# EAGLE design KHR-1_Breakout_schm (EAGLE 9.1.3)
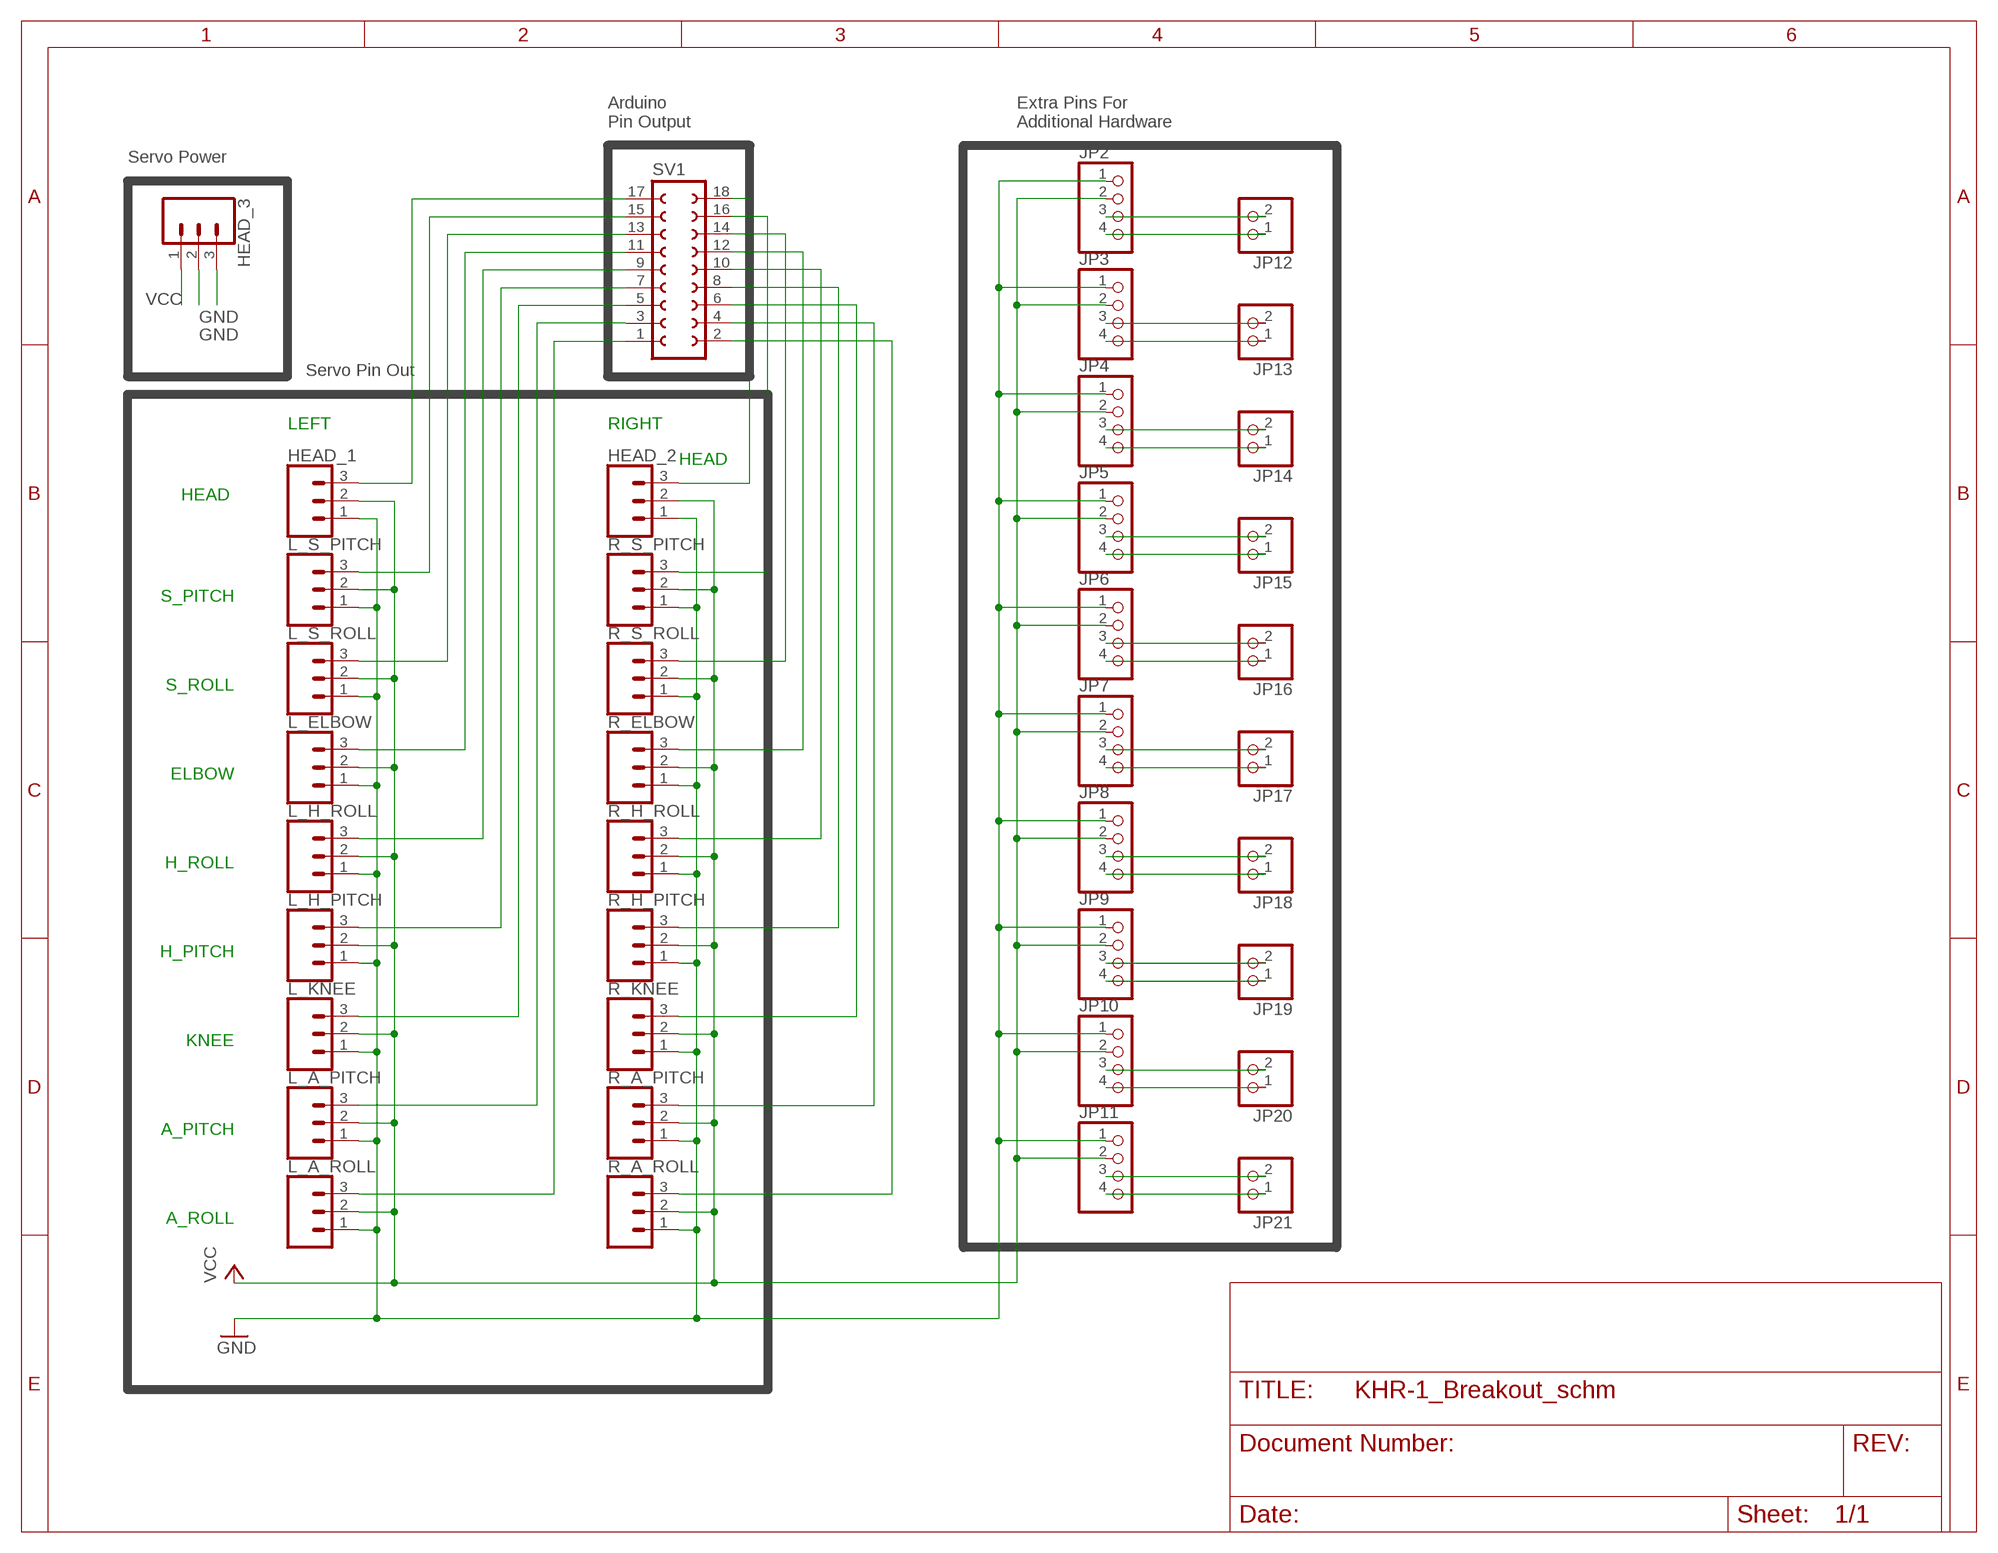
[diagram p0: schematic, sheet 1]

## Parts
HEAD_1  CONN_03  [1X03]
HEAD_2  CONN_03  [1X03]
HEAD_3  CONN_03  [1X03]
JP2  PINHD-1X4  [1X04]
JP3  PINHD-1X4  [1X04]
JP4  PINHD-1X4  [1X04]
JP5  PINHD-1X4  [1X04]
JP6  PINHD-1X4  [1X04]
JP7  PINHD-1X4  [1X04]
JP8  PINHD-1X4  [1X04]
JP9  PINHD-1X4  [1X04]
JP10  PINHD-1X4  [1X04]
JP11  PINHD-1X4  [1X04]
JP12  PINHD-1X2  [1X02]
JP13  PINHD-1X2  [1X02]
JP14  PINHD-1X2  [1X02]
JP15  PINHD-1X2  [1X02]
JP16  PINHD-1X2  [1X02]
JP17  PINHD-1X2  [1X02]
JP18  PINHD-1X2  [1X02]
JP19  PINHD-1X2  [1X02]
JP20  PINHD-1X2  [1X02]
JP21  PINHD-1X2  [1X02]
L_A_PITCH  CONN_03  [1X03]
L_A_ROLL  CONN_03  [1X03]
L_ELBOW  CONN_03  [1X03]
L_H_PITCH  CONN_03  [1X03]
L_H_ROLL  CONN_03  [1X03]
L_KNEE  CONN_03  [1X03]
L_S_PITCH  CONN_03  [1X03]
L_S_ROLL  CONN_03  [1X03]
R_A_PITCH  CONN_03  [1X03]
R_A_ROLL  CONN_03  [1X03]
R_ELBOW  CONN_03  [1X03]
R_H_PITCH  CONN_03  [1X03]
R_H_ROLL  CONN_03  [1X03]
R_KNEE  CONN_03  [1X03]
R_S_PITCH  CONN_03  [1X03]
R_S_ROLL  CONN_03  [1X03]
SV1  FE09-2  [FE09-2]

## Nets
GND: HEAD_1.1 HEAD_2.1 HEAD_3.2 HEAD_3.3 JP2.1 JP3.1 JP4.1 JP5.1 JP6.1 JP7.1 JP8.1 JP9.1 JP10.1 JP11.1 L_A_PITCH.1 L_A_ROLL.1 L_ELBOW.1 L_H_PITCH.1 L_H_ROLL.1 L_KNEE.1 L_S_PITCH.1 L_S_ROLL.1 R_A_PITCH.1 R_A_ROLL.1 R_ELBOW.1 R_H_PITCH.1 R_H_ROLL.1 R_KNEE.1 R_S_PITCH.1 R_S_ROLL.1
N$1: HEAD_1.3 SV1.17
N$2: L_S_PITCH.3 SV1.15
N$3: L_S_ROLL.3 SV1.13
N$4: L_ELBOW.3 SV1.11
N$5: L_H_ROLL.3 SV1.9
N$6: L_H_PITCH.3 SV1.7
N$7: L_KNEE.3 SV1.5
N$8: L_A_PITCH.3 SV1.3
N$9: L_A_ROLL.3 SV1.1
N$10: HEAD_2.3 SV1.18
N$11: R_S_PITCH.3 SV1.16
N$12: R_S_ROLL.3 SV1.14
N$13: R_ELBOW.3 SV1.12
N$14: R_H_ROLL.3 SV1.10
N$15: R_H_PITCH.3 SV1.8
N$16: R_KNEE.3 SV1.6
N$17: R_A_PITCH.3 SV1.4
N$18: R_A_ROLL.3 SV1.2
N$19: JP2.3 JP12.2
N$20: JP2.4 JP12.1
N$21: JP3.3 JP13.2
N$22: JP3.4 JP13.1
N$23: JP4.3 JP14.2
N$24: JP4.4 JP14.1
N$25: JP5.3 JP15.2
N$26: JP5.4 JP15.1
N$27: JP6.3 JP16.2
N$28: JP6.4 JP16.1
N$29: JP7.3 JP17.2
N$30: JP7.4 JP17.1
N$31: JP8.3 JP18.2
N$32: JP8.4 JP18.1
N$33: JP9.3 JP19.2
N$34: JP9.4 JP19.1
N$35: JP10.3 JP20.2
N$36: JP10.4 JP20.1
N$37: JP11.3 JP21.2
N$38: JP11.4 JP21.1
VCC: HEAD_1.2 HEAD_2.2 HEAD_3.1 JP2.2 JP3.2 JP4.2 JP5.2 JP6.2 JP7.2 JP8.2 JP9.2 JP10.2 JP11.2 L_A_PITCH.2 L_A_ROLL.2 L_ELBOW.2 L_H_PITCH.2 L_H_ROLL.2 L_KNEE.2 L_S_PITCH.2 L_S_ROLL.2 R_A_PITCH.2 R_A_ROLL.2 R_ELBOW.2 R_H_PITCH.2 R_H_ROLL.2 R_KNEE.2 R_S_PITCH.2 R_S_ROLL.2

## Notes on the sheet
- Arduino
  Pin Output
- Extra Pins For
  Additional Hardware
- Servo Power
- Servo Pin Out
- LEFT | RIGHT
- HEAD
- HEAD
- S_PITCH
- S_ROLL
- ELBOW
- H_ROLL
- H_PITCH
- KNEE
- A_PITCH
- A_ROLL

## Library data of the parts
HEAD_1-HEAD_3 L_A_PITCH L_A_ROLL L_ELBOW L_H_PITCH L_H_ROLL L_KNEE L_S_PITCH L_S_ROLL R_A_PITCH R_A_ROLL R_ELBOW R_H_PITCH R_H_ROLL R_KNEE R_S_PITCH R_S_ROLL = SparkFun-Connectors:CONN_03: Multi connection point. Often used as Generic Header-pin footprint for 0.1 inch spaced/style header connections On any of the 0.1 inch spaced packages, you can populate with these: Break Away Headers - Straight <https://www.sparkfun.com/products/116> (PRT-00116) Break Away Male Headers - Right Angle <https://www.sparkfun.com/products/553> (PRT-00553) Female Headers <https://www.sparkfun.com/products/115> (PRT-00115) Break Away Headers - Machine Pin <https://www.sparkfun.com/products/117> (PRT-00117) Break Away Female Headers - Swiss Machine Pin <https://www.sparkfun.com/products/743> (PRT-00743) Stackable Header - 3 Pin (Female, 0.1") <https://www.sparkfun.com/products/13875> (PRT-13875) For SCREWTERMINALS and SPRING TERMINALS visit here: Screw Terimnals on SparkFun.com <https://www.sparkfun.com/search/results?term=Screw+Terminals> (5mm/3.5mm/2.54mm spacing) This device is also useful as a general connection point to wire up your design to another part of your project. Our various solder wires solder well into these plated through hole pads. Hook-Up Wire - Assortment (Stranded, 22 AWG) <https://www.sparkfun.com/products/11375> (PRT-11375) Hook-Up Wire - Assortment (Solid Core, 22 AWG) <https://www.sparkfun.com/products/11367> (PRT-11367) View the entire wire category on our website here <https://www.sparkfun.com/categories/141> Special notes: Molex polarized connector foot print use with SKU : PRT-08232 with associated crimp pins and housings.
JP2-JP11 = pinhead:PINHD-1X4: PIN HEADER
JP12-JP21 = pinhead:PINHD-1X2: PIN HEADER
SV1 = con-lsta:FE09-2: FEMALE HEADER; OC_FARNELL: unknown; OC_NEWARK: unknown

## Board
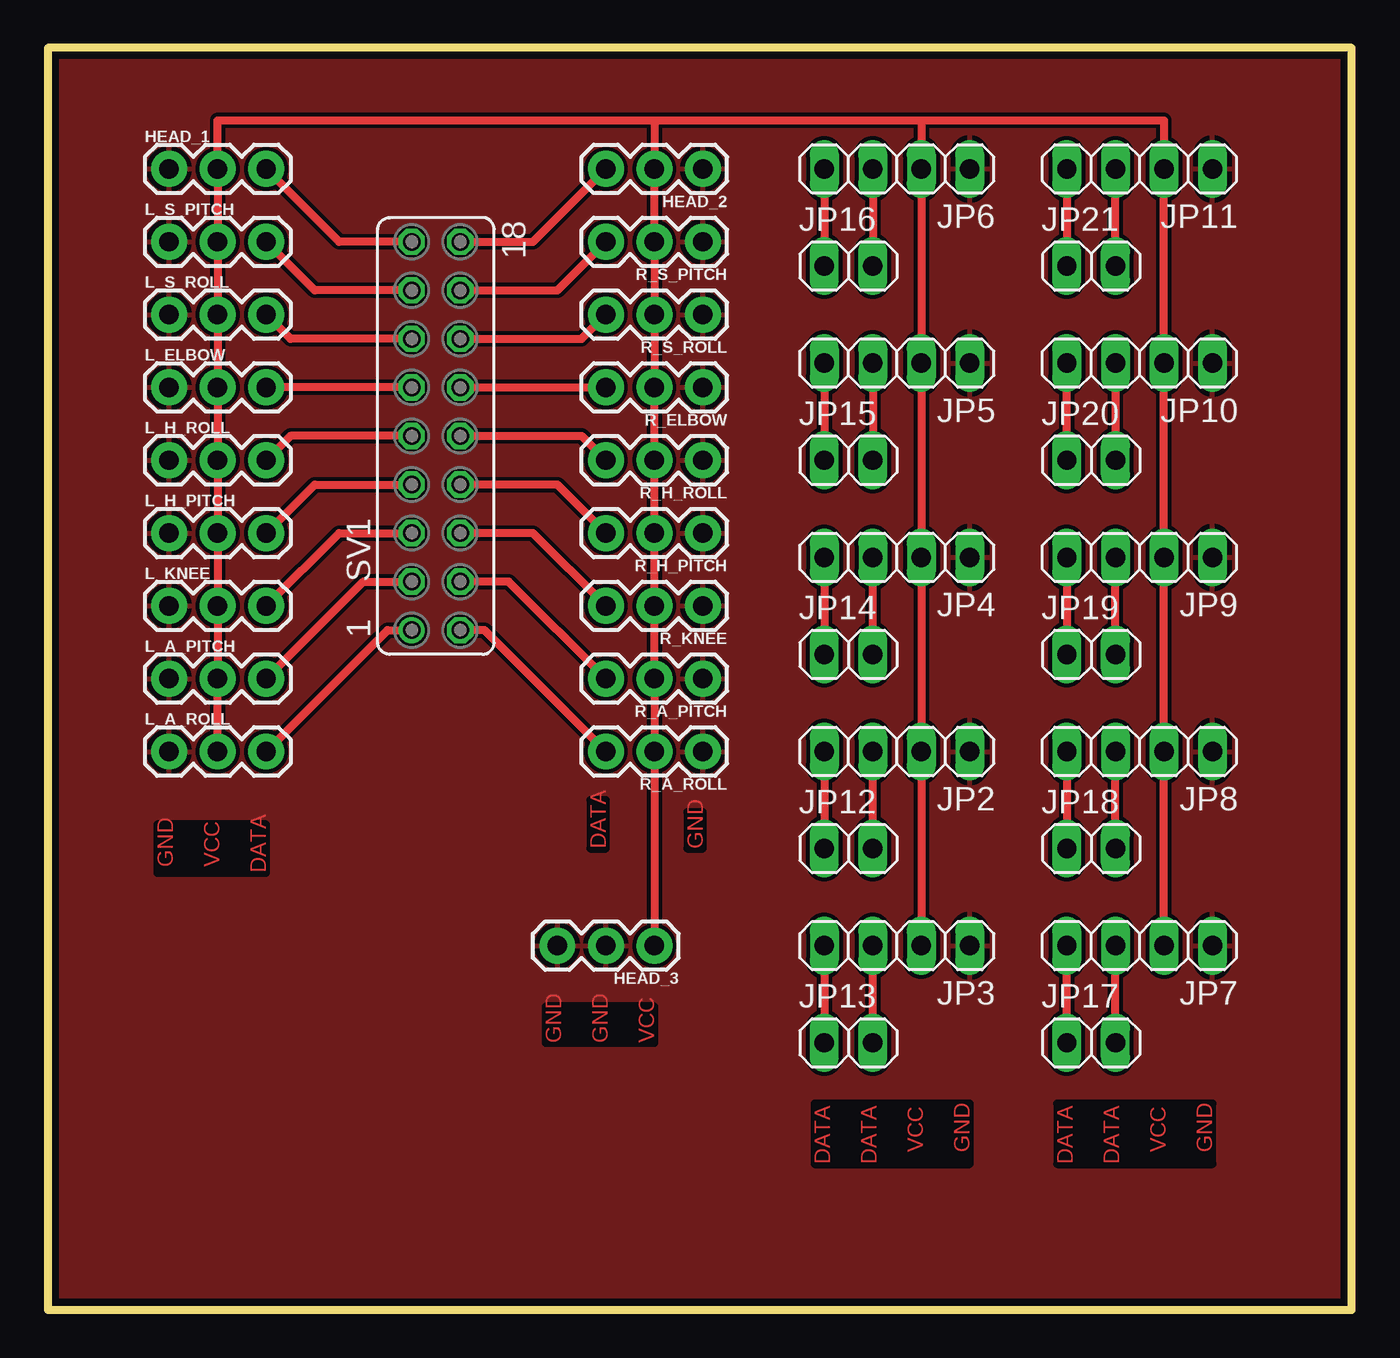
[diagram p1: board, top side]
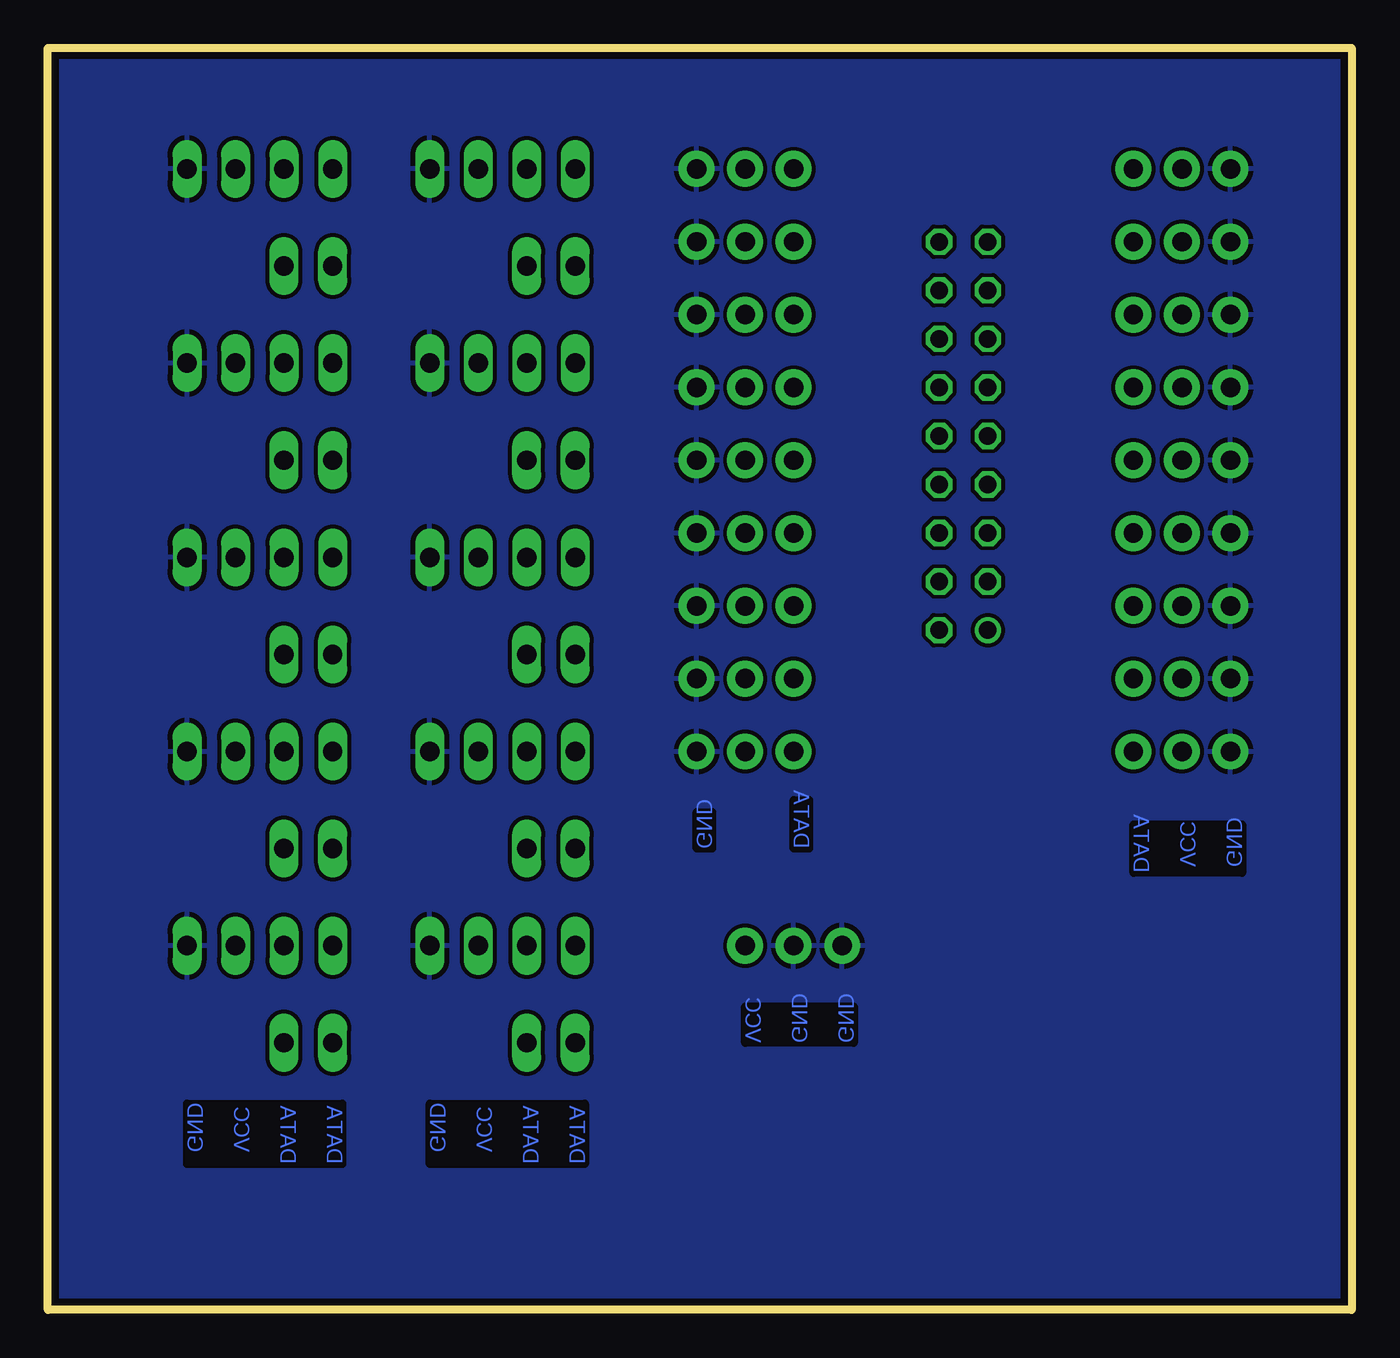
[diagram p2: board, bottom side, seen from below]

Size 68.25 x 66.03 mm. Coordinates in mm from the lower left corner, seen from the top.
Outline: 0,0 68.25,0 68.25,66.03 0,66.03 0,0
Copper layers (1*16): Top 0.0178mm / dielectric 59mil / Bottom 0.0178mm
Design rules "epl-lpkf": minimum track width 8mil, minimum drill 0.35mm, track to track 8mil, track to pad 8mil, pad to pad 8mil, via to via 8mil, smd to smd 8mil, copper to edge 15mil, drill to drill 15mil, minimum pad ring 8mil, minimum via ring 8mil, stop-mask expansion 3mil, vias tented up to drill 0mil, thermal gap 10mil

### Footprints (pad centres in the part's own frame; a part is rotated, then mirrored left to right if it is on the bottom)
1X03 = drill 1.016 pad 1.88: 1 0,0; 2 2.54,0; 3 5.08,0
1X04 = drill 1.016 long: 1 -3.81,0; 2 -1.27,0; 3 1.27,0; 4 3.81,0
1X02 = drill 1.016 long: 1 -1.27,0; 2 1.27,0
FE09-2 = drill 0.914: 1 -10.16,1.27 | drill 0.914 octagon: 2 -10.16,-1.27; 3 -7.62,1.27; 4 -7.62,-1.27; 5 -5.08,1.27; 6 -5.08,-1.27; 7 -2.54,1.27; 8 -2.54,-1.27; 9 0,1.27; 10 0,-1.27; 11 2.54,1.27; 12 2.54,-1.27; 13 5.08,1.27; 14 5.08,-1.27; 15 7.62,1.27; 16 7.62,-1.27; 17 10.16,1.27; 18 10.16,-1.27

### Placement (x,y rotation side)
HEAD_1  6.35,59.69 0 top
HEAD_2  34.29,59.69 180 top
HEAD_3  31.75,19.05 180 top
JP2  44.45,29.21 180 top
JP3  44.45,19.05 180 top
JP4  44.45,39.37 180 top
JP5  44.45,49.53 180 top
JP6  44.45,59.69 180 top
JP7  57.15,19.05 180 top
JP8  57.15,29.21 180 top
JP9  57.15,39.37 180 top
JP10  57.15,49.53 180 top
JP11  57.15,59.69 180 top
JP12  41.91,24.13 0 top
JP13  41.91,13.97 0 top
JP14  41.91,34.29 0 top
JP15  41.91,44.45 0 top
JP16  41.91,54.61 0 top
JP17  54.61,13.97 0 top
JP18  54.61,24.13 0 top
JP19  54.61,34.29 0 top
JP20  54.61,44.45 0 top
JP21  54.61,54.61 0 top
L_A_PITCH  6.35,33.02 0 top
L_A_ROLL  6.35,29.21 0 top
L_ELBOW  6.35,48.26 0 top
L_H_PITCH  6.35,40.64 0 top
L_H_ROLL  6.35,44.45 0 top
L_KNEE  6.35,36.83 0 top
L_S_PITCH  6.35,55.88 0 top
L_S_ROLL  6.35,52.07 0 top
R_A_PITCH  34.29,33.02 180 top
R_A_ROLL  34.29,29.21 180 top
R_ELBOW  34.29,48.26 180 top
R_H_PITCH  34.29,40.64 180 top
R_H_ROLL  34.29,44.45 180 top
R_KNEE  34.29,36.83 180 top
R_S_PITCH  34.29,55.88 180 top
R_S_ROLL  34.29,52.07 180 top
SV1  20.32,45.72 90 top

### Tracks (layer width: path | path; a pad name or v marks a point on that pad's centre or on a via)
GND
  pour Top: 0,66.04 68.58,66.04 68.58,0 0,0
  pour Bottom: 0,66.04 68.58,66.04 68.58,0 0,0
N$1
  Top 0.406: SV1.17 15.24,55.88 HEAD_1.3
N$2
  Top 0.406: SV1.15 13.97,53.34 L_S_PITCH.3
N$3
  Top 0.406: SV1.13 12.7,50.8 L_S_ROLL.3
N$4
  Top 0.406: SV1.11 L_ELBOW.3
N$5
  Top 0.406: SV1.9 12.7,45.72 L_H_ROLL.3
N$6
  Top 0.406: L_H_PITCH.3 13.97,43.18 SV1.7
N$7
  Top 0.406: L_KNEE.3 15.24,40.64 SV1.5
N$8
  Top 0.406: L_A_PITCH.3 16.51,38.1 SV1.3
N$9
  Top 0.406: L_A_ROLL.3 17.78,35.56 SV1.1
N$10
  Top 0.406: SV1.18 25.4,55.88 HEAD_2.3
N$11
  Top 0.406: SV1.16 26.67,53.34 R_S_PITCH.3
N$12
  Top 0.406: SV1.14 27.94,50.8 R_S_ROLL.3
N$13
  Top 0.406: SV1.12 R_ELBOW.3
N$14
  Top 0.406: SV1.10 27.94,45.72 R_H_ROLL.3
N$15
  Top 0.406: R_H_PITCH.3 26.67,43.18 SV1.8
N$16
  Top 0.406: R_KNEE.3 25.4,40.64 SV1.6
N$17
  Top 0.406: R_A_PITCH.3 24.13,38.1 SV1.4
N$18
  Top 0.406: R_A_ROLL.3 22.86,35.56 SV1.2
N$19
  Top 0.406: JP12.2 JP2.3
N$20
  Top 0.406: JP2.4 JP12.1
N$21
  Top 0.406: JP13.2 JP3.3
N$22
  Top 0.406: JP3.4 JP13.1
N$23
  Top 0.406: JP14.2 JP4.3
N$24
  Top 0.406: JP4.4 JP14.1
N$25
  Top 0.406: JP5.3 JP15.2
N$26
  Top 0.406: JP5.4 JP15.1
N$27
  Top 0.406: JP6.3 JP16.2
N$28
  Top 0.406: JP6.4 JP16.1
N$29
  Top 0.406: JP17.2 JP7.3
N$30
  Top 0.406: JP17.1 JP7.4
N$31
  Top 0.406: JP18.2 JP8.3
N$32
  Top 0.406: JP8.4 JP18.1
N$33
  Top 0.406: JP19.2 JP9.3
N$34
  Top 0.406: JP9.4 JP19.1
N$35
  Top 0.406: JP10.3 JP20.2
N$36
  Top 0.406: JP20.1 JP10.4
N$37
  Top 0.406: JP21.2 JP11.3
N$38
  Top 0.406: JP11.4 JP21.1
VCC
  Top 0.406: 31.75,62.23 8.89,62.23 HEAD_1.2 L_S_PITCH.2 L_S_ROLL.2 L_ELBOW.2 L_H_ROLL.2 L_H_PITCH.2 L_KNEE.2 L_A_PITCH.2 L_A_ROLL.2 | 31.75,62.23 HEAD_2.2 R_S_PITCH.2 R_S_ROLL.2 R_ELBOW.2 R_H_ROLL.2 R_H_PITCH.2 R_KNEE.2 R_A_PITCH.2 R_A_ROLL.2 HEAD_3.1 | 31.75,62.23 45.72,62.23 | 45.72,62.23 JP6.2 JP5.2 JP4.2 JP2.2 JP3.2 | 45.72,62.23 58.42,62.23 JP11.2 JP10.2 JP9.2 JP8.2 JP7.2

### Text on the board
Top: DATA | GND | GND / / VCC / / DATA | GND / / GND / / VCC | DATA / / DATA / / VCC / / GND | DATA / / DATA / / VCC / / GND
Bottom: DATA | GND | GND / / VCC / / DATA | GND / / GND / / VCC | DATA / / DATA / / VCC / / GND | DATA / / DATA / / VCC / / GND